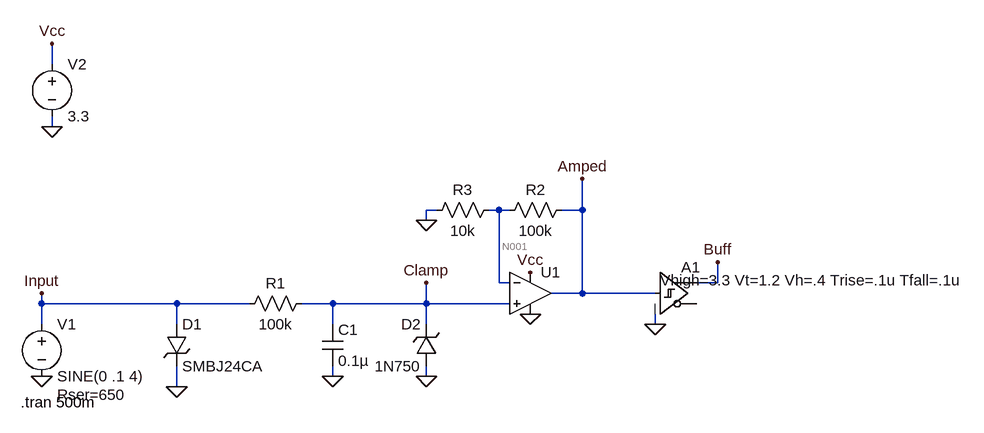
[diagram p0: schematic input-sim.asc]
input-sim.asc, the LTspice schematic file:
Version 4
SHEET 1 1440 680
WIRE -16 -272 -16 -304
WIRE -16 -176 -16 -192
WIRE 576 -48 560 -48
WIRE 672 -48 656 -48
WIRE 688 -48 672 -48
WIRE 800 -48 800 -96
WIRE 800 -48 768 -48
WIRE 560 -32 560 -48
WIRE 672 64 672 -48
WIRE 688 64 672 64
WIRE 1008 64 1008 32
WIRE 1008 64 976 64
WIRE 800 80 800 -48
WIRE 800 80 752 80
WIRE 912 80 800 80
WIRE -32 96 -32 80
WIRE 176 96 -32 96
WIRE 288 96 176 96
WIRE 416 96 368 96
WIRE 560 96 560 64
WIRE 560 96 416 96
WIRE 688 96 560 96
WIRE -32 128 -32 96
WIRE 176 128 176 96
WIRE 416 128 416 96
WIRE 560 128 560 96
WIRE 912 128 912 112
WIRE 416 208 416 192
WIRE 560 208 560 192
WIRE 176 224 176 192
FLAG -32 208 0
FLAG 176 224 0
FLAG 416 208 0
FLAG 560 208 0
FLAG 560 64 Clamp
FLAG -32 80 Input
FLAG -16 -176 0
FLAG -16 -304 Vcc
FLAG 720 112 0
FLAG 720 48 Vcc
FLAG 560 -32 0
FLAG 800 -96 Amped
FLAG 1008 32 Buff
FLAG 912 128 0
SYMBOL voltage -32 112 R0
WINDOW 123 0 0 Left 0
WINDOW 39 24 124 Left 2
SYMATTR SpiceLine Rser=650
SYMATTR InstName V1
SYMATTR Value SINE(0 .1 4)
SYMBOL TVSdiode 160 128 R0
SYMATTR InstName D1
SYMATTR Value SMBJ24CA
SYMBOL res 384 80 R90
WINDOW 0 0 56 VBottom 2
WINDOW 3 32 56 VTop 2
SYMATTR InstName R1
SYMATTR Value 100k
SYMBOL cap 400 128 R0
SYMATTR InstName C1
SYMATTR Value 0.1µ
SYMBOL zener 576 192 R180
WINDOW 0 24 64 Left 2
WINDOW 3 24 0 Left 2
SYMATTR InstName D2
SYMATTR Value 1N750
SYMBOL voltage -16 -288 R0
WINDOW 123 0 0 Left 0
WINDOW 39 0 0 Left 0
SYMATTR InstName V2
SYMATTR Value 3.3
SYMBOL res 784 -64 R90
WINDOW 0 0 56 VBottom 2
WINDOW 3 32 56 VTop 2
SYMATTR InstName R2
SYMATTR Value 100k
SYMBOL res 672 -64 R90
WINDOW 0 0 56 VBottom 2
WINDOW 3 32 56 VTop 2
SYMATTR InstName R3
SYMATTR Value 10k
SYMBOL Digital\\schmitt 912 16 R0
WINDOW 3 8 44 Left 2
SYMATTR Value Vhigh=3.3 Vt=1.2 Vh=.4 Trise=.1u Tfall=.1u
SYMATTR InstName A1
SYMBOL Opamps\\UniversalOpamp2 720 80 R0
SYMATTR InstName U1
TEXT -64 248 Left 2 !.tran 500m

The netlist it stands for:
* input-sim.asc
V1 Input 0 SINE(0 .1 4) Rser=650
D1 Input 0 SMBJ24CA
R1 Clamp Input 100k
C1 Clamp 0 0.1µ
D2 0 Clamp 1N750
V2 Vcc 0 3.3
R2 Amped N001 100k
R3 N001 0 10k
A1 Amped 0 0 0 0 0 Buff 0 SCHMITT Vhigh=3.3 Vt=1.2 Vh=.4 Trise=.1u Tfall=.1u
XU1 Clamp N001 Vcc 0 Amped level.2 Avol=1Meg GBW=10Meg Slew=10Meg ilimit=25m rail=0 Vos=0 phimargin=45 en=0 enk=0 in=0 ink=0 Rin=500Meg  ; pins IN+ IN- V+ V- OUT
.model D D
.lib standard.dio
.tran 500m
.lib UniversalOpamps2.sub
.backanno
.end

* Results of the author's LTspice run, read from the files saved beside the schematic
* Operating Point, zero values left out:
*   V(input) = 2.131 µV
*   V(clamp) = 330 µV
*   V(vcc) = 3.3 V
*   V(amped) = 19.52 mV
*   V(n001) = 1.804 mV
*   I(D2) = -20.99 pA
*   I(R3) = 180.4 nA
*   I(R2) = 177.1 nA
*   I(R1) = 3.278 nA
*   I(V2) = -25.42 µA
*   I(V1) = 3.278 nA
*   Ix(u1:1) = -3.299 nA
*   Ix(u1:2) = -3.296 nA
*   Ix(u1:3) = 25.42 µA
*   Ix(u1:4) = -25.21 µA
*   Ix(u1:5) = -177.1 nA
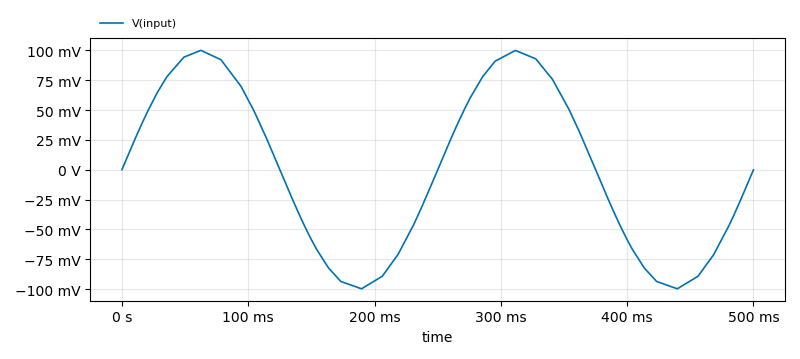
[diagram p1: Transient Analysis of input-sim.asc, plotted from the saved traces]
* Transient Analysis, 1 run:
*   V(input): min -99.79 mV, max 99.96 mV, average -3.992 µV, rms 70.22 mV, last -149.1 µV